# Altium project nRF54L15_miniDevKit.PrjPcb
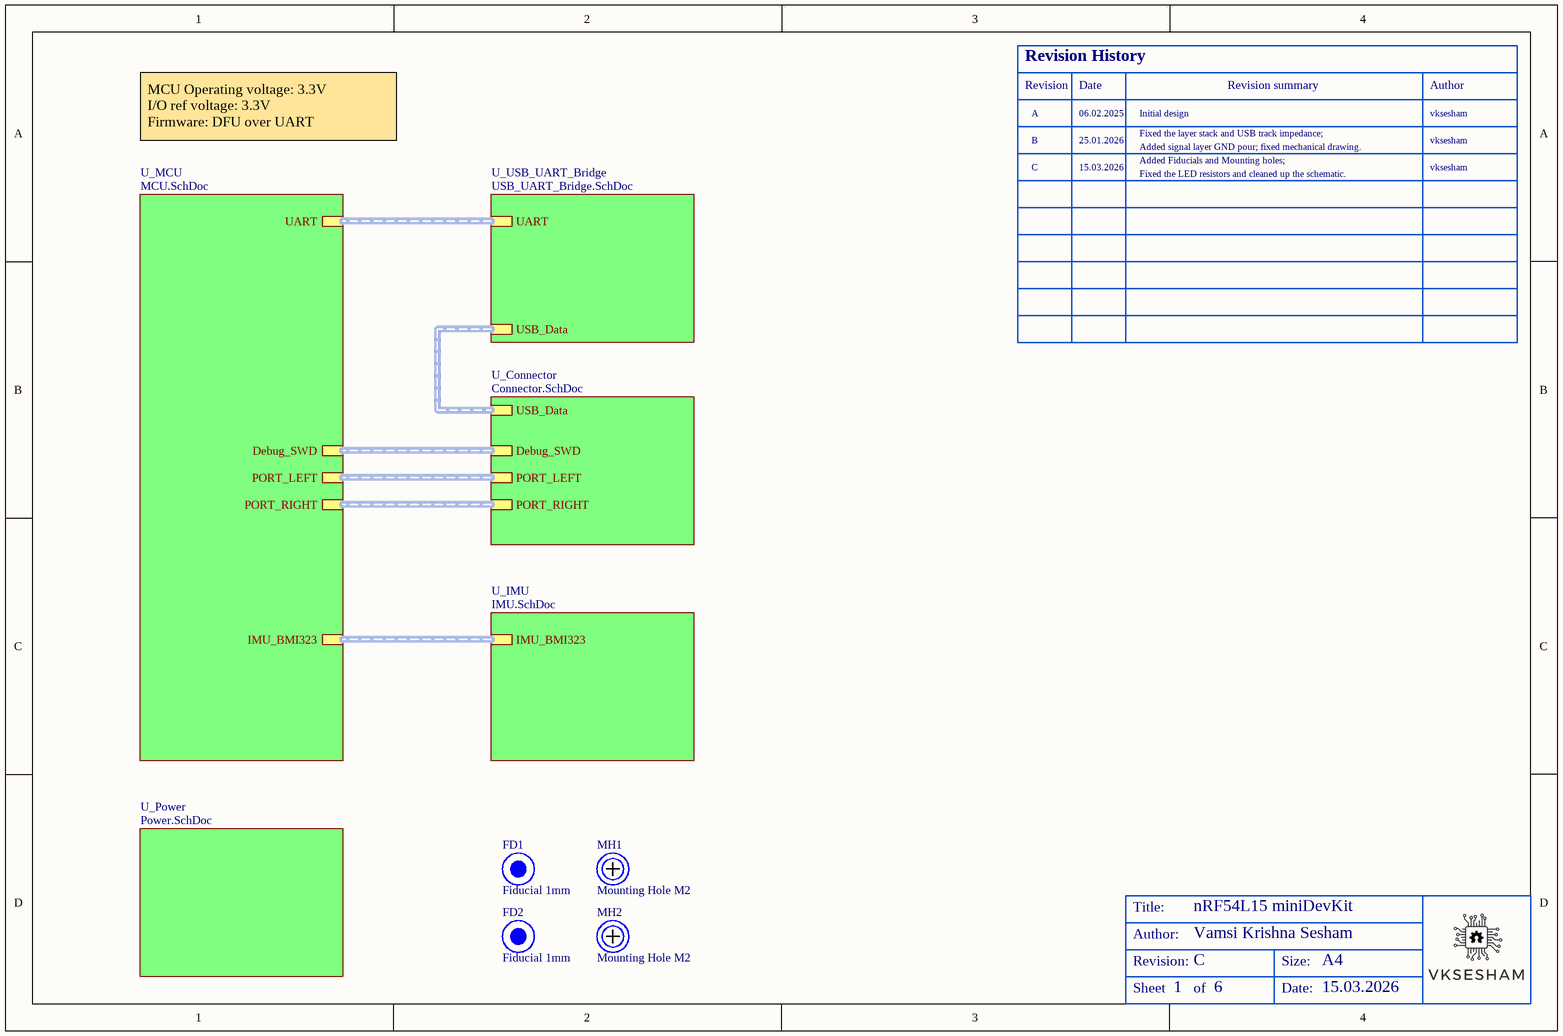
[diagram p0: Top-level.SchDoc]
6 sheets, 68 parts. Net scope: hierarchical (ports join the sheet entries above them; power ports are global).
Board file: PCB1.PcbDoc
Sheets:
  Top-level.SchDoc
    U_MCU = MCU.SchDoc
    U_Connector = Connector.SchDoc
    U_IMU = IMU.SchDoc
    U_Power = Power.SchDoc
    U_USB_UART_Bridge = USB_UART_Bridge.SchDoc

## Sheet Top-level.SchDoc: nRF54L15 miniDevKit
size A4; Date: 15.03.2026; Author: Vamsi Krishna Sesham; DrawnBy: Vamsi Krishna Sesham; Revision: C; SheetNumber: 1; SheetTotal: 6

### Parts
(Parts that share a designator on the sheet are numbered #1, #2 ... from top to bottom, then left to right.)
*#1  RevisionHistory  (value not drawn)  (graphical)
*#2  TitleBlock  (value not drawn)  (graphical)
FD1  Fiducial 1mm  [Fiducial_1mm]  (no BOM)
FD2  Fiducial 1mm  [Fiducial_1mm]  (no BOM)
MH1  Mounting Hole M2  [Mounting Hole M2]  (no BOM)
MH2  Mounting Hole M2  [Mounting Hole M2]  (no BOM)

### Sub-sheets
U_Connector = Connector.SchDoc: USB_Data (harness USB), Debug_SWD (harness SWD), PORT_LEFT (harness Conn_R), PORT_RIGHT (harness Conn_L)
U_IMU = IMU.SchDoc: IMU_BMI323 (harness IMU)
U_MCU = MCU.SchDoc: UART (harness USB_UART), IMU_BMI323 (harness IMU), Debug_SWD (harness SWD), PORT_LEFT (harness Conn_R), PORT_RIGHT (harness Conn_L)
U_Power = Power.SchDoc: no entries
U_USB_UART_Bridge = USB_UART_Bridge.SchDoc: USB_Data (harness USB), UART (harness USB_UART)

### Buses and harness runs
harness sheet U_Connector/Debug_SWD = sheet U_MCU/Debug_SWD
harness sheet U_Connector/PORT_LEFT = sheet U_MCU/PORT_LEFT
harness sheet U_Connector/PORT_RIGHT = sheet U_MCU/PORT_RIGHT
harness sheet U_Connector/USB_Data = sheet U_USB_UART_Bridge/USB_Data
harness sheet U_IMU/IMU_BMI323 = sheet U_MCU/IMU_BMI323
harness sheet U_MCU/UART = sheet U_USB_UART_Bridge/UART

### Notes on the sheet
- A
- 06.02.2025
- Initial design
- vksesham
- MCU Operating voltage: 3.3V
  I/O ref voltage: 3.3V
  Firmware: DFU over UART
- B
- C
- 25.01.2026
- 15.03.2026
- Fixed the layer stack and USB track impedance;
- Added signal layer GND pour; fixed mechanical drawing.
- Added Fiducials and Mounting holes;
- Fixed the LED resistors and cleaned up the schematic.
- (in symbol RevisionHistory) Revision History; Revision; Date; Revision summary; Author
- (in symbol TitleBlock) Title:; Author:; Revision:; Size:; A4; Sheet; of; Date:

## Sheet MCU.SchDoc: MCU
size A4; Date: 15.03.2026; Author: Vamsi Krishna Sesham; DrawnBy: Vamsi Krishna Sesham; Engineer: Vamsi Krishna Sesham; Revision: C; SheetNumber: 2; SheetTotal: 6
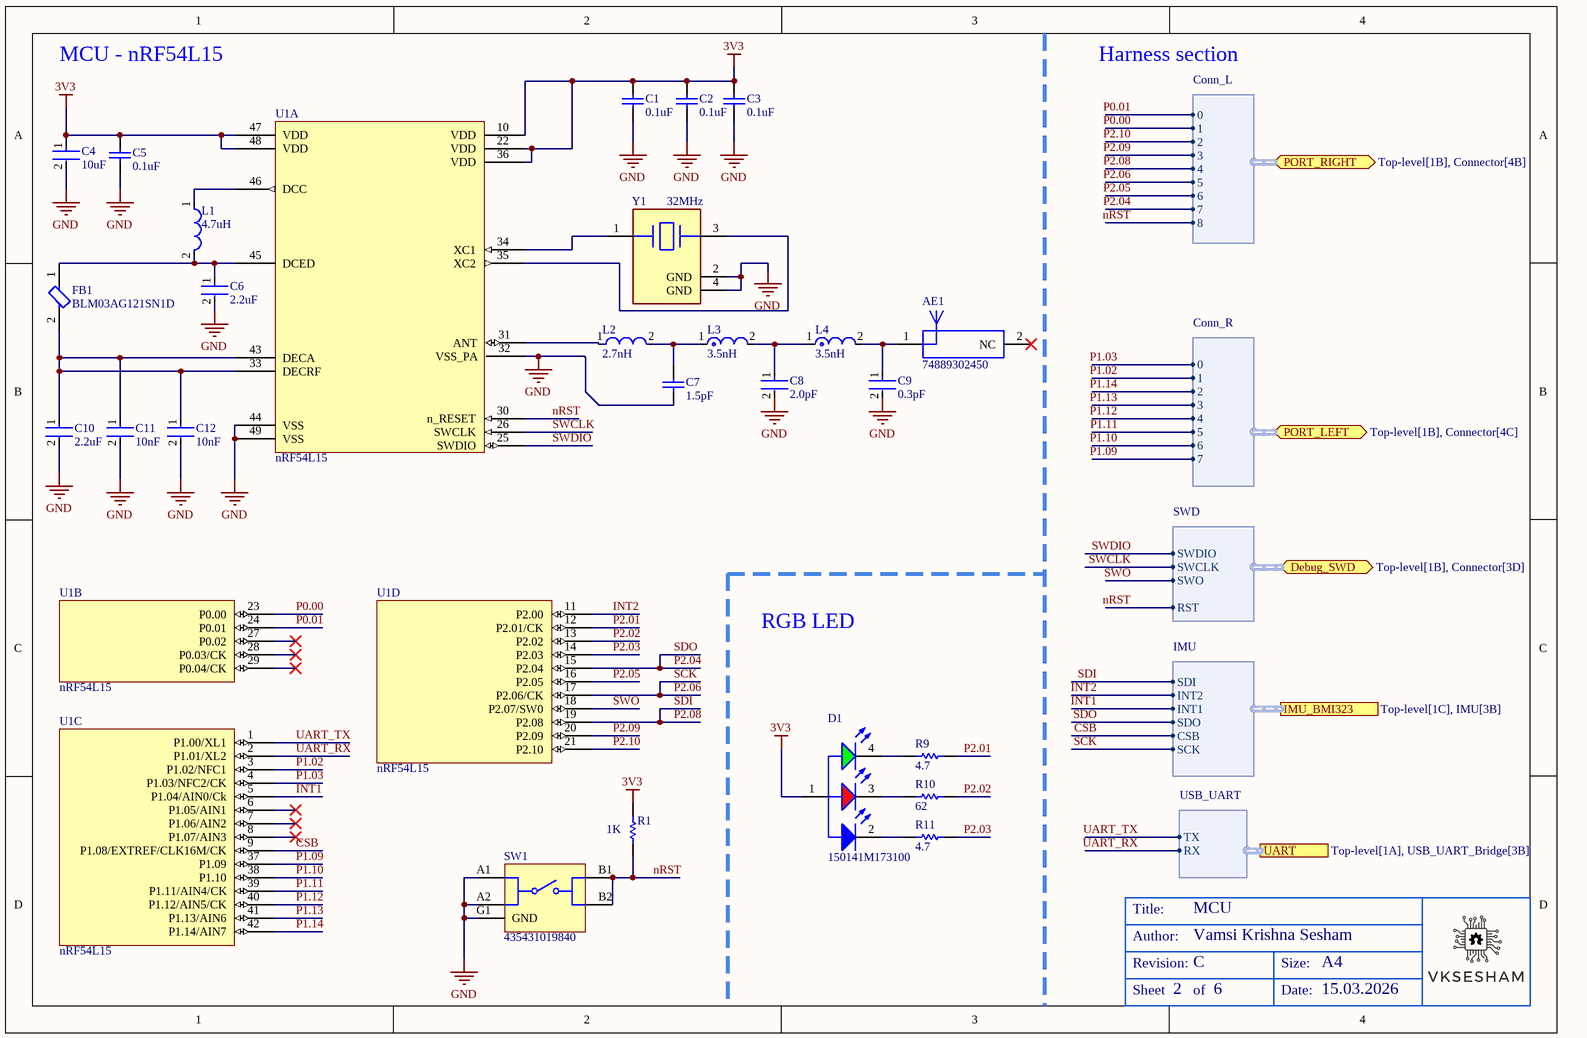
[diagram p1: MCU.SchDoc]

### Parts
(Parts that share a designator on the sheet are numbered #1, #2 ... from top to bottom, then left to right.)
*#3  TitleBlock  (value not drawn)  (graphical)
AE1  74889302450  [74889302450]
C1  0.1uF  [CAPC0603X33X15ML03T05]
C2  0.1uF  [CAPC0603X33X15ML03T05]
C3  0.1uF  [CAPC0603X33X15ML03T05]
C4  10uF  [FP-CL07-IPC_C]
C5  0.1uF  [CAPC0603X33X15ML03T05]
C6  2.2uF  [FP-CL03-IPC_B]
C7  1.5pF  [CAPC0603X33X15NL03T05]
C8  2.0pF  [FP-GRM033-0_03-MFG]
C9  0.3pF  [FP-GJM033-0_03-IPC_A]
C10  2.2uF  [FP-CL03-IPC_B]
C11  10nF  [FP-GRM033-0_03-IPC_B]
C12  10nF  [FP-GRM033-0_03-IPC_B]
D1  150141M173100  [WL-SFTW_3528_150141M173100]
FB1  BLM03AG121SN1D  [FP-BLM03-0_03-d0_3-IPC_A]
L1  4.7uH  [FP-MLZ1608-IPC_A]
L2  2.7nH  [FP-LQP03HQ_02-MFG]
L3  3.5nH  [FP-LQP03TG_02-IPC_C]
L4  3.5nH  [FP-LQP03TG_02-IPC_C]
R1  1K  [RESC0603X28X15ML05T05]
R9  4.7  [RESC0402(1005)_M]
R10  62  [RESC1005X40X25LL05T05]
R11  4.7  [RESC0402(1005)_M]
SW1  435431019840  [435431019840]
U1  nRF54L15  [nRF54L15_QFN8_6X6]  (parts A,B,C,D of 4)
Y1  32MHz  [FP-ABM8G-MFG]

### Ports
Debug_SWD (bidir, harness SWD, see Top-level[1B], Connector[3D]), IMU_BMI323 (harness IMU, see Top-level[1C], IMU[3B]), PORT_LEFT (bidir, harness Conn_R, see Top-level[1B], Connector[4C]), PORT_RIGHT (bidir, harness Conn_L, see Top-level[1B], Connector[4B]), UART (harness USB_UART, see Top-level[1A], USB_UART_Bridge[3B])

### Harnesses
USB_UART: TX, RX
IMU: SDI, INT2, INT1, SDO, CSB, SCK
SWD: SWDIO, SWCLK, SWO, RST
Conn_R: 0, 1, 2, 3, 4, 5, 6, 7
Conn_L: 0, 1, 2, 3, 4, 5, 6, 7, 8

### Nets
3V3: C1.2 C2.2 C3.2 C4.1 C5.2 D1.1(A) R1.2 U1.10(VDD) U1.22(VDD) U1.36(VDD) U1.47(VDD) U1.48(VDD)
GND: C1.1 C2.1 C3.1 C4.2 C5.1 C6.2 C7.1 C8.2 C9.2 C10.2 C11.2 C12.2 SW1.A1 SW1.A2 SW1.G1(GND) U1.32(VSS_PA) U1.44(VSS) U1.49(VSS) Y1.2(GND) Y1.4(GND)
CSB: U1.9(P1.08/EXTREF/CLK16M/CK) ; port IMU_BMI323.CSB
INT1: U1.5(P1.04/AIN0/Ck) ; port IMU_BMI323.INT1
INT2: U1.11(P2.00) ; port IMU_BMI323.INT2
nRST: R1.1 SW1.B1 SW1.B2 U1.30(n_RESET) ; port Debug_SWD.RST, port PORT_RIGHT.8
P0.00: U1.23(P0.00) ; port PORT_RIGHT.1
P0.01: U1.24(P0.01) ; port PORT_RIGHT.0
P1.02: U1.3(P1.02/NFC1) ; port PORT_LEFT.1
P1.03: U1.4(P1.03/NFC2/CK) ; port PORT_LEFT.0
P1.09: U1.37(P1.09) ; port PORT_LEFT.7
P1.10: U1.38(P1.10) ; port PORT_LEFT.6
P1.11: U1.39(P1.11/AIN4/CK) ; port PORT_LEFT.5
P1.12: U1.40(P1.12/AIN5/CK) ; port PORT_LEFT.4
P1.13: U1.41(P1.13/AIN6) ; port PORT_LEFT.3
P1.14: U1.42(P1.14/AIN7) ; port PORT_LEFT.2
P2.01: R9.2 U1.12(P2.01/CK)
P2.02: R10.2 U1.13(P2.02)
P2.03: R11.2 U1.14(P2.03)
P2.04: U1.15(P2.04) ; port IMU_BMI323.SDO, port PORT_RIGHT.7  [also labelled SDO]
P2.05: U1.16(P2.05) ; port PORT_RIGHT.6
P2.06: U1.17(P2.06/CK) ; port IMU_BMI323.SCK, port PORT_RIGHT.5  [also labelled SCK]
P2.08: U1.19(P2.08) ; port IMU_BMI323.SDI, port PORT_RIGHT.4  [also labelled SDI]
P2.09: U1.20(P2.09) ; port PORT_RIGHT.3
P2.10: U1.21(P2.10) ; port PORT_RIGHT.2
SWCLK: U1.26(SWCLK) ; port Debug_SWD.SWCLK
SWDIO: U1.25(SWDIO) ; port Debug_SWD.SWDIO
SWO: U1.18(P2.07/SW0) ; port Debug_SWD.SWO
UART_RX: U1.2(P1.01/XL2) ; port UART.RX
UART_TX: U1.1(P1.00/XL1) ; port UART.TX
NetAE1_1: AE1.1(Feed) C9.1 L4.2
NetC6_1: C6.1 FB1.1 L1.2 U1.45(DCED)
NetC7_2: C7.2 L2.2 L3.1
NetC8_1: C8.1 L3.2 L4.1
NetC10_1: C10.1 C11.1 C12.1 FB1.2 U1.33(DECRF) U1.43(DECA)
NetD1_2: D1.2(K) R11.1
NetD1_3: D1.3(K) R10.1
NetD1_4: D1.4(K) R9.1
NetL1_1: L1.1 U1.46(DCC)
NetL2_1: L2.1 U1.31(ANT)
NetU1_34: U1.34(XC1) Y1.1
NetU1_35: U1.35(XC2) Y1.3

Not connected (* = marked no-connect by the designer): AE1 2(NC)*; U1 6(P1.05/AIN1)* 7(P1.06/AIN2)* 8(P1.07/AIN3)* 27(P0.02)* 28(P0.03/CK)* 29(P0.04/CK)*

### Notes on the sheet
- MCU - nRF54L15
- Harness section
- RGB LED
- (in symbol TitleBlock) Title:; Author:; Revision:; Size:; A4; Sheet; of; Date:

### Library data of the parts
AE1 = CMP-03913-126098687-1: 74889302450 Chip Antenna, 2.45Ghz, 3.2Mm X 1.6Mm X 1.2Mm Rohs Compliant: Yes; Current Rating: 2A; Impedance: 50Ω; RoHS: Compliant; Length: 3.2mm; Width: 1.6mm; NexarPartId: 126098687; Max Operating Temperature: 85°C; Min Operating Temperature: -40°C; Height: 1.2mm
C1-C3 C5 = CMP-2010-00674-1: Manufacturer: Samsung; Part Number: CL03A104KQ3NNNC
C4 = CMP-13271-002778-1: Cap Ceramic 10uF 10V X5R ±20% SMD 0402 +85°C Paper T/R; Length: 0.039inch; Mount: Surface Mount; Case Code (Imperial): 0402; Capacitance: 10uF; Max Operating Temperature: 85°C; Voltage Rating: 10V; Min Operating Temperature: -55°C; Case/Package: 0402; Thickness: 0.035inch; Width: 0.02inch; Case Code (Metric): 1005; Packaging: Tape and Reel; Tolerance: 20%
C6 C10 = CMP-13271-002263-1: Cap Ceramic 2.2uF 10V X5R ±20% Pad SMD 0201 +85°C T/R; Width: 0.012inch; Case Code (Imperial): 0201; Lead Free: Lead Free; Thickness: 0.013inch; Packaging: Tape and Reel; Capacitance: 2.2uF; Min Operating Temperature: -55°C; Case Code (Metric): 0603; Length: 0.024inch; Voltage Rating: 10V; Case/Package: 0201; Mount: Surface Mount; Tolerance: 20%; Max Operating Temperature: 85°C
C7 = CMP-1033-00061-2: Part Number: 02013A1R5CAT2A; Manufacturer: AVX Interconnect / Elco
C8 = CMP-2010-01348-2: Chip Multilayer Ceramic Capacitors for General Purpose, 0201, 2.0pF, C0G, 30ppm/°C, 0.25pF, 25V; Capacitance: 2pF; Voltage Rating (DC): 25V; Case Code (Metric): 0603; REACH SVHC: No SVHC; Length: 0.024inch; Height: 0.3mm; Case Code (Imperial): 0201; Min Operating Temperature: -55°C; Max Operating Temperature: 125°C; Mount: Surface Mount; Thickness: 0.013inch; Dielectric: C0G; Case/Package: 0201; Termination: SMD/SMT; Width: 0.012inch; Package Quantity: 15000; Voltage Rating: 25V; Packaging: Tape and Reel; Lead Free: Lead Free
C9 = CMP-2010-00788-2: Ceramic Capacitor 0.3pF ±0.05pF 25V C0G 0201 (0603 Metric); Case/Package: 0201; Capacitance: 0.3pF; Length: 0.6mm; Voltage Rating (DC): 25V; Max Operating Temperature: 125°C; Mount: Surface Mount; Depth: 0.3mm; Min Operating Temperature: -55°C; Voltage Rating: 25V; Case Code (Imperial): 0201; Dielectric: C0G; Package Quantity: 15000; Lead Free: Lead Free; Width: 0.3mm; Case Code (Metric): 0603; Height: 0.3mm; Radiation Hardening: No; Termination: SMD/SMT; Packaging: Tape and Reel; Thickness: 0.013inch
C11 C12 = CMP-2010-01684-2: Chip Multilayer Ceramic Capacitors for General Purpose, 0201, 10000pF, X7R, 15%, 10%, 10V; Package Quantity: 1; Width: 0.012inch; Voltage: 10V; Mount: Surface Mount; Capacitance: 10nF; Voltage Rating (DC): 10V; Voltage Rating: 10V; Length: 0.6mm; Packaging: Tape and Reel; Material: Ceramic; Dielectric: X7R; REACH SVHC: No SVHC; Termination: SMD/SMT; Case/Package: 0201; Radiation Hardening: No; Height: 0.3mm; Tolerance: 10%; Case Code (Imperial): 0201; Min Operating Temperature: -55°C; Lead Free: Lead Free; Thickness: 0.013inch; Depth: 0.3mm; Case Code (Metric): 0603; Max Operating Temperature: 125°C
D1 = CMP-1431-00001-2: NexarPartId: 29717795; Forward Current: 100mA; Peak Wavelength: 465nm; Viewing Angle: 120°; Color: Green, Red; Max Reverse Voltage (DC): 5V; Forward Voltage: 3.2V; Dominant Wavelength: 520nm; Test Current: 20mA; Power Dissipation: 72mW; Wavelength: 470nm; Lens Style: Clear, Round; Luminous Intensity: 230mcd; Case/Package: 1411; Packaging: Tape and Reel; Case Code (Metric): 3528; Min Operating Temperature: -40°C; Length: 3.5mm; Number of Pins: 4; Width: 2.8mm; Max Operating Temperature: 85°C; Case Code (Imperial): 1411; Height: 1.9mm; REACH SVHC: Unknown; Mount: Surface Mount; RoHS: Compliant
FB1 = CMP-0686-00046-3: Ferrite Bead, 0201, 120Ω @ 100MHz, 25%, 0.5Ω, 200mA; Number of Lines: 1; Impedance: 120R; DC Resistance (DCR): 500mR; Shielding: Unshielded; Material: Steel; Max Current Rating: 200mA; Tolerance: 25%; Case Code (Metric): 0603; Max DC Current: 200mA; Max Operating Temperature: 125°C; Length: 0.6mm; Test Frequency: 100MHz; Package Quantity: 1; Height: 0.3mm; Case Code (Imperial): 0201; Case/Package: 0201; DC Resistance-Max: 500mR; Termination: SMD/SMT; Min Operating Temperature: -55°C; Series: BLM03AG; Core Material: Ferrite; Depth: 0.33mm; Lead Free: Lead Free; Packaging: Tape and Reel; Frequency: 100MHz; Number of Circuits: 1; REACH SVHC: No SVHC; Number of Pins: 2; Current Rating: 200mA; Width: 0.3mm; RoHS Compliant: Yes
L1 = CMP-08253-000311-1: Shielded Multilayer Inductor 4.7uH ±20% 350mA 650mΩ SMD 0603; DC Resistance (DCR): 650mR; Test Frequency: 2MHz; Self Resonant Frequency: 80MHz; Core Material: Ferrite; Saturation Current: 120mA; Packaging: Tape and Reel; Width: 0.031inch; Height - Seated (Max): 0.037inch; Inductance: 4.7uH; Current Rating: 350mA; Max Operating Temperature: 125°C; Tolerance: 20%; Length: 0.063inch; Package Quantity: 4000; Case/Package: 0603; Case Code (Imperial): 0603; Min Operating Temperature: -55°C; Case Code (Metric): 1608; RoHS Compliant: Yes; Shielding: Shielded; Mount: Surface Mount
L2 = CMP-06042-004733-1: Film type RF Inductor 2.7nH ±0.1nH 600mA 0.12Ω 0201 (0603); Self Resonant Frequency: 9GHz; Shielding: Unshielded; Test Frequency: 500MHz; DC Resistance (DCR): 120mR; Core Material: Non-Magnetic; Current Rating: 600mA; Max Operating Temperature: 125°C; Case/Package: 0201; Case Code (Metric): 0603; Inductance: 2.7nH; Case Code (Imperial): 0201; Min Operating Temperature: -55°C; Mount: Surface Mount; Resistor Type: Thin Film; Packaging: Tape and Reel
L3 L4 = CMP-06042-011870-1: Film type RF Inductor 3.5nH ±0.1nH 450mA 0.25Ω 0201 (0603); DC Resistance (DCR): 250mR; Shielding: Unshielded; Core Material: Non-Magnetic; Self Resonant Frequency: 7GHz; Q Factor: 14; Test Frequency: 500MHz; Current Rating: 450mA; Resistor Type: Thin Film; Max DC Current: 450mA; Case/Package: 0201; Case Code (Metric): 0603; Lead Free: Lead Free; Height: 0.3mm; Height - Seated (Max): 0.013inch; Case Code (Imperial): 0201; Length: 0.024inch; Packaging: Tape and Reel; Package Quantity: 15000; Mount: Surface Mount; Max Operating Temperature: 125°C; Termination: SMD/SMT; Width: 0.012inch; Min Operating Temperature: -55°C; Inductance: 3.5nH
R1 = CMP-2004-00209-1: Manufacturer: Vishay Dale; Part Number: CRCW02011K00FNED
R9 R11 = CMP-1011-00018-1: 4R7 0.063W 5% 0402 (1005 Metric)  SMD; Value: 4.70 Ohm; Case-EIA: 0402; Case-Metric: 1005; Power: 0.063 W; Technology: SMT; Tolerance: 5 %
R10 = CMP-2002-00152-1: Part Number: CRCW040262R0JNED; Manufacturer: Vishay Dale
SW1 = CMP-03913-134708202-2: Tactile Switch, 0.05A, 32VDC, SMD, 400GF Rohs Compliant: Yes; Voltage Rating: 32V; Current Rating: 50mA; Insulation Resistance: 1GΩ; RoHS: Compliant; Packaging: Tape and Reel; Max Operating Temperature: 125°C; Contact Plating: Silver; Min Operating Temperature: -55°C
U1 = nRF54L15_QFN8_6X6: Ultra-low-power wireless SoC; Manufacturer 1: Nordic Semiconductor; Manufacturer Part Number 1: NRF54L15-QFAA-R7
Y1 = CMP-27762-014975-1: Crystal 32MHz ±30ppm (Tol) ±30ppm (Stability) 10pF FUND 50Ω 4-Pin SMD T/R; ESR (Equivalent Series Resistance): 50R; Depth: 2.5mm; Frequency: 32MHz; Min Operating Temperature: -20°C; Lead Free: Lead Free; Termination: SMD/SMT; Load Capacitance: 10pF; Mount: Surface Mount; Max Operating Temperature: 70°C; Frequency Stability: 30ppm; Series: ABM8G; Tolerance: 30ppm; Width: 2.5mm; Packaging: Tape and Reel; Frequency Tolerance: 30ppm; Package Quantity: 1000; Series Resistance: 50R; Number of Pins: 4; Length: 3.2mm; Case/Package: CSMD; Height: 1mm

## Sheet Connector.SchDoc: Connector
size A4; Date: 15.03.2026; Author: Vamsi Krishna Sesham; DrawnBy: Vamsi Krishna Sesham; Engineer: Vamsi Krishna Sesham; Revision: C; SheetNumber: 3; SheetTotal: 6
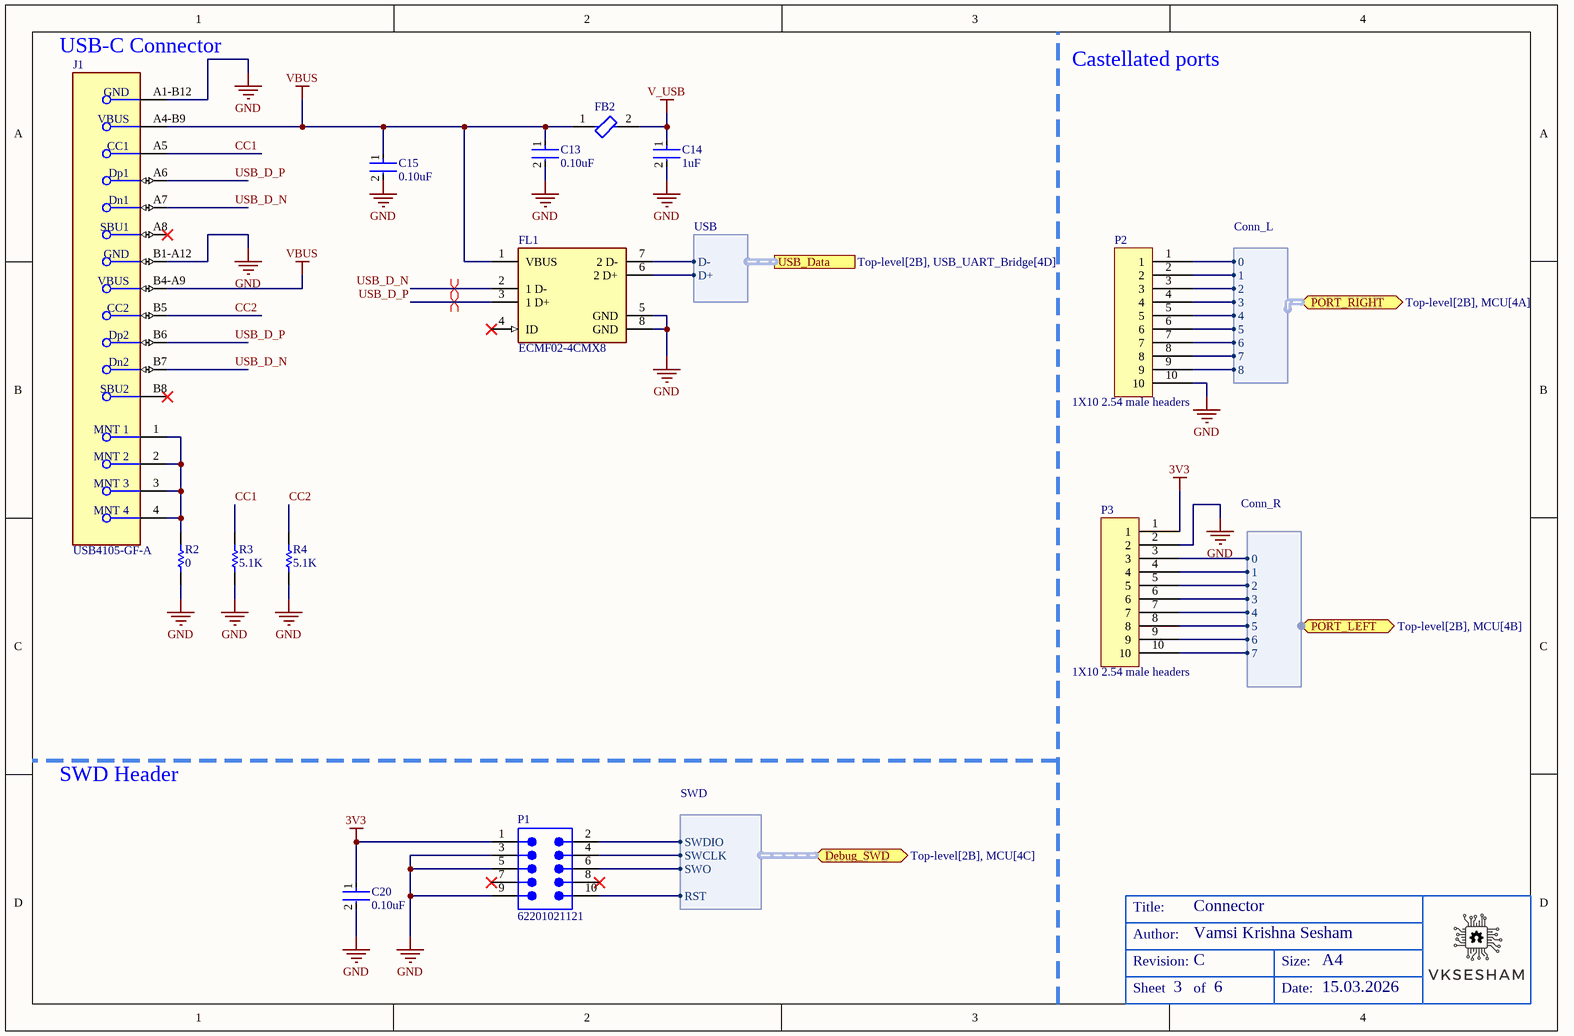
[diagram p2: Connector.SchDoc]

### Parts
(Parts that share a designator on the sheet are numbered #1, #2 ... from top to bottom, then left to right.)
*#4  TitleBlock  (value not drawn)  (graphical)
C13  0.10uF  [FP-GRM033-0_03-MFG]
C14  1uF  [FP-CL03-IPC_C]
C15  0.10uF  [FP-GRM033-0_03-MFG]
C20  0.10uF  [FP-GRM033-0_03-MFG]
FB2  (no value)  [FP-BLM03-0_03-d0_3-IPC_C]
FL1  ECMF02-4CMX8  [FP-Micro_QFN-8L-MFG]
J1  USB4105-GF-A  [FP-USB4105-GF-A-MFG]
P1  62201021121  [62201021121]
P2  1X10 2.54 male headers  [Male_Headers_254_1x10]  (no BOM)
P3  1X10 2.54 male headers  [Male_Headers_254_1x10]  (no BOM)
R2  0  [RESC1005X40X25NL05T10]
R3  5.1K  [RESC0603X26X15NL03T05]
R4  5.1K  [RESC0603X26X15NL03T05]

### Ports
Debug_SWD (bidir, harness SWD, see Top-level[2B], MCU[4C]), PORT_LEFT (bidir, harness Conn_R, see Top-level[2B], MCU[4B]), PORT_RIGHT (bidir, harness Conn_L, see Top-level[2B], MCU[4A]), USB_Data (harness USB, see Top-level[2B], USB_UART_Bridge[4D])

### Harnesses
USB: D-, D+
SWD: SWDIO, SWCLK, SWO, RST
Conn_R: 0, 1, 2, 3, 4, 5, 6, 7
Conn_L: 0, 1, 2, 3, 4, 5, 6, 7, 8

### Nets
3V3: C20.1 P1.1 P3.1
GND: C13.2 C14.2 C15.2 C20.2 FL1.5(GND) FL1.8(GND) J1.A1-B12(GND) J1.B1-A12(GND) P1.3 P1.5 P1.9 P2.10 P3.2 R2.1 R3.1 R4.1
V_USB: C14.1 FB2.2
VBUS: C13.1 C15.1 FB2.1 FL1.1(VBUS) J1.A4-B9(VBUS) J1.B4-A9(VBUS)
CC1: J1.A5(CC1) R3.2
CC2: J1.B5(CC2) R4.2
nRST: P1.10 P2.9 ; port Debug_SWD.RST, port PORT_RIGHT.8
P0.00: P2.2 ; port PORT_RIGHT.1
P0.01: P2.1 ; port PORT_RIGHT.0
P1.02: P3.4 ; port PORT_LEFT.1
P1.03: P3.3 ; port PORT_LEFT.0
P1.09: P3.10 ; port PORT_LEFT.7
P1.10: P3.9 ; port PORT_LEFT.6
P1.11: P3.8 ; port PORT_LEFT.5
P1.12: P3.7 ; port PORT_LEFT.4
P1.13: P3.6 ; port PORT_LEFT.3
P1.14: P3.5 ; port PORT_LEFT.2
P2.04: P2.8 ; port PORT_RIGHT.7
P2.05: P2.7 ; port PORT_RIGHT.6
P2.06: P2.6 ; port PORT_RIGHT.5
P2.08: P2.5 ; port PORT_RIGHT.4
P2.09: P2.4 ; port PORT_RIGHT.3
P2.10: P2.3 ; port PORT_RIGHT.2
SWCLK: P1.4 ; port Debug_SWD.SWCLK
SWDIO: P1.2 ; port Debug_SWD.SWDIO
SWO: P1.6 ; port Debug_SWD.SWO
USB_D_N: FL1.2(1_D-) J1.A7(Dn1) J1.B7(Dn2)
USB_D_P: FL1.3(1_D+) J1.A6(Dp1) J1.B6(Dp2)
USBD_N: FL1.6(2_D+) ; port USB_Data.D+
USBD_P: FL1.7(2_D-) ; port USB_Data.D-
NetJ1_1: J1.1(MNT_1) J1.2(MNT_2) J1.3(MNT_3) J1.4(MNT_4) R2.2

Not connected (* = marked no-connect by the designer): FL1 4(ID)*; J1 A8(SBU1)* B8(SBU2)*; P1 7* 8*

### Layout directives
differential pair: USB_D_N, USB_D_P

### Notes on the sheet
- (near J1) USB-C Connector
- Castellated ports
- SWD Header
- (in symbol TitleBlock) Title:; Author:; Revision:; Size:; A4; Sheet; of; Date:

### Library data of the parts
C13 C15 C20 = CMP-06035-019037-1: Chip Multilayer Ceramic Capacitors for General Purpose, 0201, 0.10uF, X7S, 22%, 10%, 16V; Capacitance: 100nF; Dielectric: X7S; Tolerance: 10%; Voltage Rating (DC): 16V; Height: 0.3mm; Max Operating Temperature: 125°C; Case Code (Metric): 0603; Termination: SMD/SMT; Min Operating Temperature: -55°C; Mount: Surface Mount; Case/Package: 0201; Weight: 1.2E-05oz; Package Quantity: 15000; Length: 0.024inch; Voltage Rating: 16V; Case Code (Imperial): 0201; Packaging: Tape and Reel; Thickness: 0.013inch; Width: 0.3mm
C14 = CMP-13271-000008-1: CAP CER 1UF 16V X5R 0201; Manufacturer Part Number: CL03A105MO3NRNH; Manufacturer: Samsung Electro-Mechanics; Tolerance: 20%; Material: Ceramic; Temperature Coefficient: 15%; Automotive: No; Temperature Range High: +85°C; Temperature: -55°C to +85°C; Package: CL03; Capacitance: 1uF; Temperature Range Low: -55°C; Height: 0.39mm; ComponentLink2URL: http://www.samsungsem.com/global/front/downloadcms.do?path=%2F%2Fglobal%2F%2Fsupport%2F%2Fproduct-search%2F%2Fmlcc%2F%2F__icsFiles%2F%2Fafieldfile%2F%2F2018%2F%2F06%2F%2F21&fileName=CL03A105MO3NRNH.pdf; RoHS: TRUE; Value: 1uF; Lead Free: Yes; Voltage Rating: 16V; Octopart: https://octopart.com/cl03a105mo3nrnh-samsung-47681184; Device Class L2: Capacitors; ComponentLink2Description: Datasheet; Device Class L3: Ceramic Capacitors; Digikey Description: CAP CER 1UF 16V X5R 0201; Category: Cap; Temperature Characteristic: X5R; Device Class L1: Passive Components; Ipc Land Pattern Name: CAPC6030X30
FB2 = CMP-06046-002105-1: BLM03EB500SH1D, Ferrite Bead, 0201, 50Ω @ 100MHz, 25%, 0.58Ω, 400mA; RoHS Compliant: Yes
FL1 = CMP-12075-000002-1: COMMON MODE CHOKE 2LN SMD ESD; Number of Lines: 2; DC Resistance (DCR): 4R; Package Quantity: 3000; Case/Package: QFN; Width: 0.047inch; Mount: Surface Mount; Termination: Flat; Length: 0.098inch; Height: 0.022inch; Lead Free: Lead Free; Depth: 1.25mm; REACH SVHC: No SVHC; Max Operating Temperature: 85°C; Min Operating Temperature: -30°C; Number of Pins: 8; Packaging: Tape and Reel
J1 = CMP-245163-000001-1: CONN RCPT USB2.0 TYPEC 5A; Manufacturer: GCT; Voltage Rating: 20V; Is Female: yes; Current Rating: 5/6.25/1.25/0.25A; Number Of Contacts: 16; Conn Orientation: Right Angle; Device Class L1: Connectors; Category: Conn; Lead Free: Yes; RoHS: TRUE; Temperature Range High: +85°C; Digikey Description: CONN RCPT USB2.0 TYPEC 5A; Device Class L3: unset; ComponentLink2Description: Datasheet; Manufacturer Part Number: USB4105-GF-A; Package: 0; Usb Standard: USB 2.0; Device Class L2: USB Connectors; Automotive: No; Temperature Range Low: -40°C; Height: 3.46mm; Temperature: -40°C to +85°C; Contact Material: Gold,Nickel; ComponentLink2URL: https://gct.co/files/drawings/usb4105.pdf; Octopart: https://octopart.com/usb4105-gf-a-gct-106627878
P1 = CMP-1502-00948-3: NexarPartId: 32855586; Pitch: 1.27mm; Operating Supply Voltage: 100V; Connector Type: Male Pin; Contact Resistance: 20mΩ; Current Rating: 1A; Number of Contacts: 10; Gender: Male; Contact Mating Length: 3.81mm; Max Operating Temperature: 105°C; Mount: Through Hole; Number of Pins: 10; Row Spacing: 1.27mm; Lead Pitch: 1.27mm; REACH SVHC: Unknown; Min Operating Temperature: -40°C; Contact Material: Copper; Orientation: Vertical; Contact Plating: Gold; Number of Rows: 2; RoHS: Compliant; Packaging: Box; Voltage Rating: 100V; Color: Black; Height: 5.65mm; Termination: Solder; Number of Positions: 10
P2 P3 = Male_Headers_254_1x10
R2 = CMP-1011-00001-2: Manufacturer: Yageo / Phycomp; Part Number: RC0402JR-070RL
R3 R4 = CMP-2004-02525-1: Part Number: MCRE000157; Manufacturer: Multicomp

## Sheet IMU.SchDoc: IMU
size A4; Date: 15.03.2026; Author: Vamsi Krishna Sesham; DrawnBy: Vamsi Krishna Sesham; Engineer: Vamsi Krishna Sesham; Revision: C; SheetNumber: 6; SheetTotal: 6
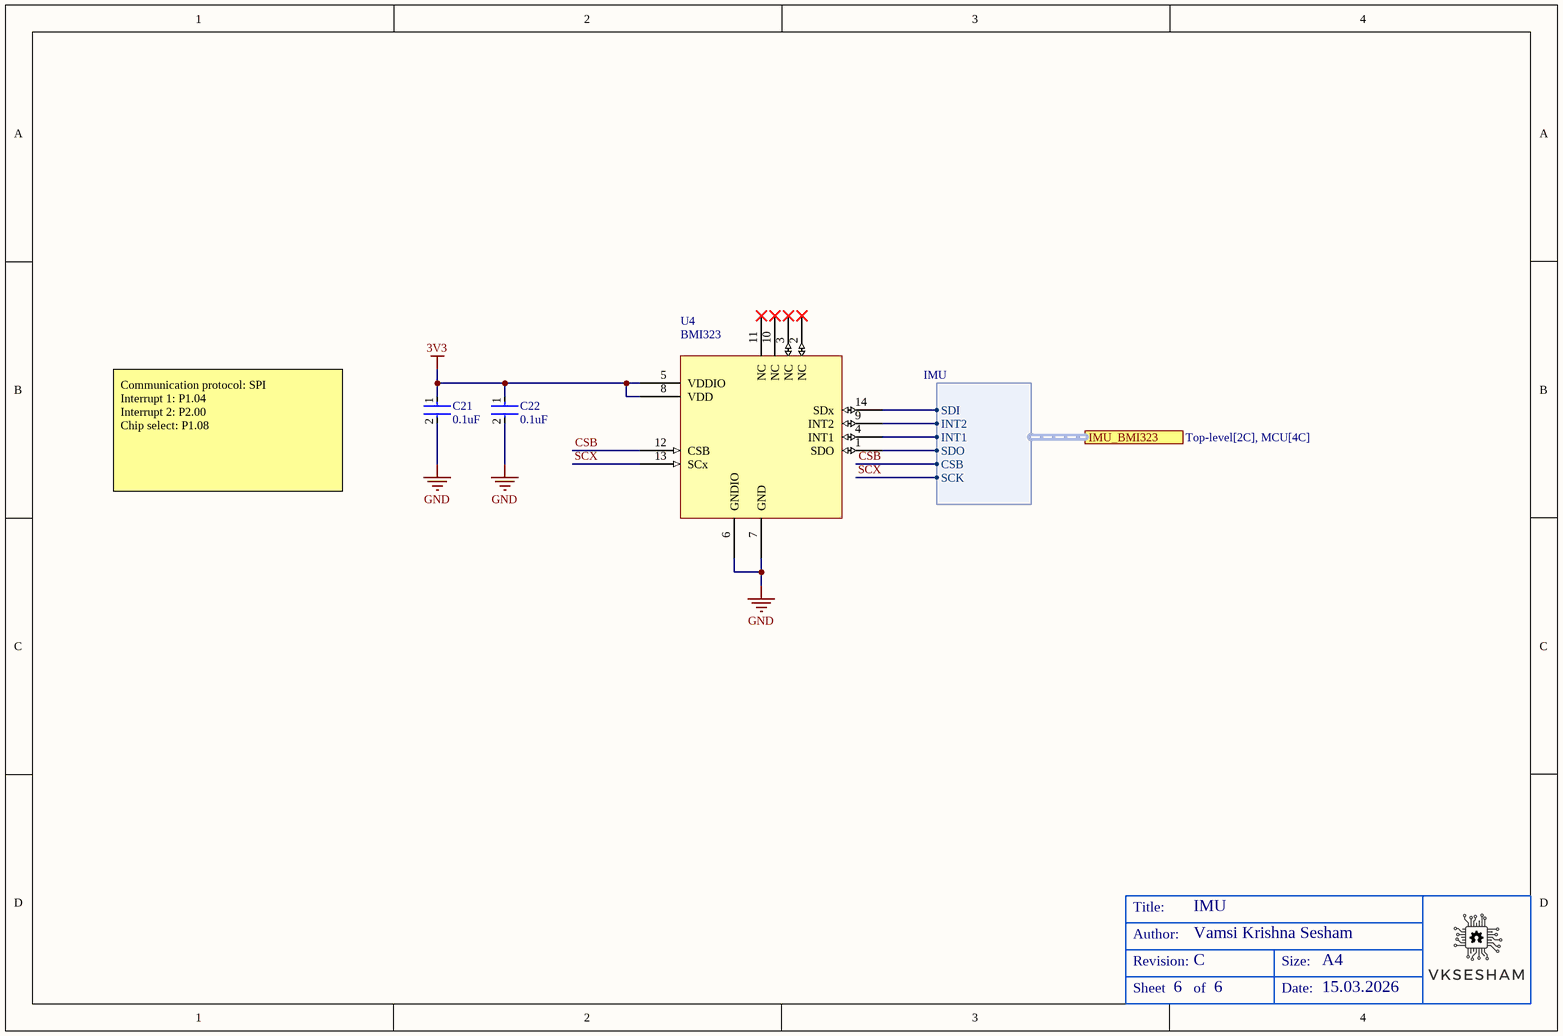
[diagram p3: IMU.SchDoc]

### Parts
(Parts that share a designator on the sheet are numbered #1, #2 ... from top to bottom, then left to right.)
*#5  TitleBlock  (value not drawn)  (graphical)
C21  0.1uF  [FP-GRM033-0_03-MFG]
C22  0.1uF  [FP-GRM033-0_03-MFG]
U4  BMI323  [BMI323]

### Ports
IMU_BMI323 (harness IMU, see Top-level[2C], MCU[4C])

### Harnesses
IMU: SDI, INT2, INT1, SDO, CSB, SCK

### Nets
3V3: C21.1 C22.1 U4.5(VDDIO) U4.8(VDD)
GND: C21.2 C22.2 U4.6(GNDIO) U4.7(GND)
CSB: U4.12(CSB) ; port IMU_BMI323.CSB
INT1: U4.4(INT1) ; port IMU_BMI323.INT1
INT2: U4.9(INT2) ; port IMU_BMI323.INT2
P2.04: U4.1(SDO) ; port IMU_BMI323.SDO
P2.08: U4.14(SDx) ; port IMU_BMI323.SDI
SCX: U4.13(SCx) ; port IMU_BMI323.SCK  [project net P2.06]

Not connected (* = marked no-connect by the designer): U4 2(NC)* 3(NC)* 10(NC)* 11(NC)*

### Notes on the sheet
- Communication protocol: SPI
  Interrupt 1: P1.04
  Interrupt 2: P2.00
  Chip select: P1.08
- (in symbol TitleBlock) Title:; Author:; Revision:; Size:; A4; Sheet; of; Date:

### Library data of the parts
C21 C22 = CMP-06035-019037-1: as C13 on sheet Connector; Dielectric: X7S; Tolerance: 10%; Voltage Rating (DC): 16V; Height: 0.3mm; Max Operating Temperature: 125°C; Case Code (Metric): 0603; Termination: SMD/SMT; Min Operating Temperature: -55°C; Mount: Surface Mount; Case/Package: 0201; Weight: 1.2E-05oz; Package Quantity: 15000; Length: 0.024inch; Voltage Rating: 16V; Case Code (Imperial): 0201; Packaging: Tape and Reel; Thickness: 0.013inch; Width: 0.3mm
U4 = BMI323: Bosch 6-axis IMU; Manufacturer 1: Bosch Sensortec; Manufacturer Part Number 1: BMI323

## Sheet Power.SchDoc: Power
size A4; Date: 15.03.2026; Author: Vamsi Krishna Sesham; DrawnBy: Vamsi Krishna Sesham; Engineer: Vamsi Krishna Sesham; Revision: C; SheetNumber: 4; SheetTotal: 6
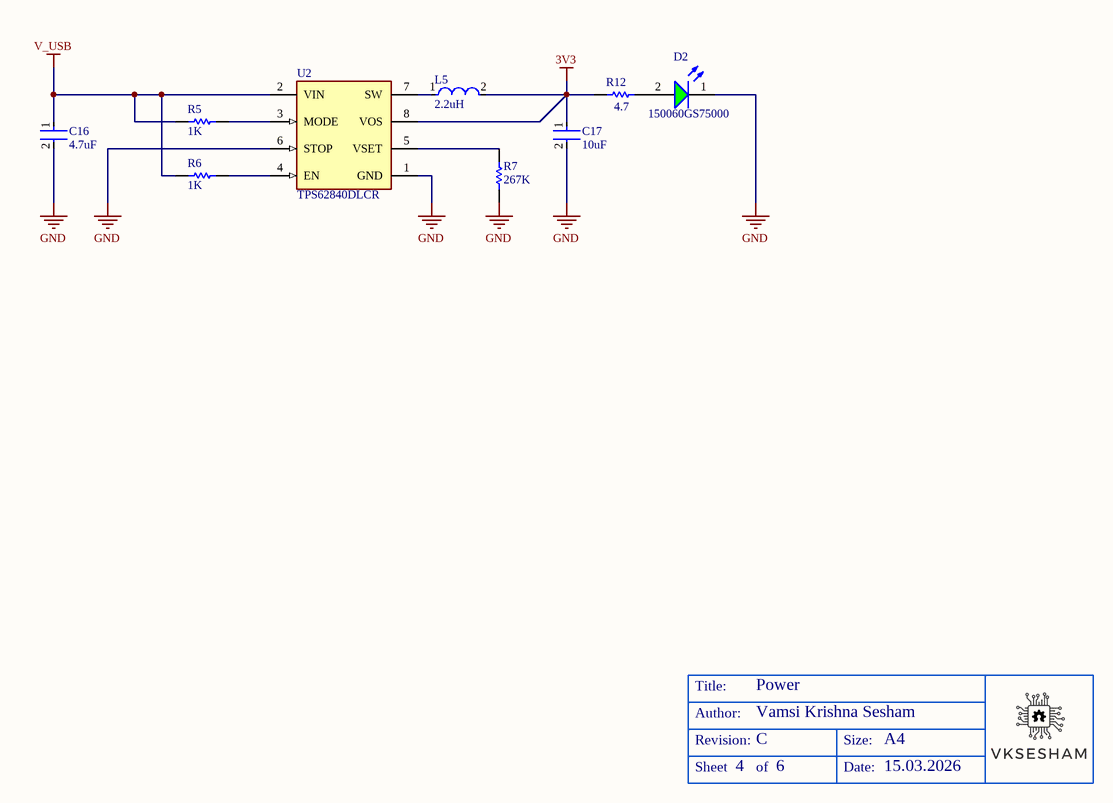
[diagram p4: Power.SchDoc]

### Parts
(Parts that share a designator on the sheet are numbered #1, #2 ... from top to bottom, then left to right.)
*#6  TitleBlock  (value not drawn)  (graphical)
C16  4.7uF  [FP-CC0402-MFG]
C17  10uF  [FP-CL07-IPC_C]
D2  150060GS75000  [WL-SMCW_0603_150060xx75000]
L5  2.2uH  [FP-DFE201612C-MFG]
R5  1K  [RESC0603X28X15ML05T05]
R6  1K  [RESC0603X28X15ML05T05]
R7  267K  [RESC1005X40X25ML05T05]
R12  4.7  [RESC0402(1005)_M]
U2  TPS62840DLCR  [FP-DLC0008B-MFG]

### Nets
3V3: C17.1 L5.2 R12.1 U2.8(VOS)
GND: C16.2 C17.2 D2.1(K) R7.1 U2.1(GND) U2.6(STOP)
V_USB: C16.1 R5.1 R6.1 U2.2(VIN)
NetD2_2: D2.2(A) R12.2
NetL5_1: L5.1 U2.7(SW)
NetR5_2: R5.2 U2.3(MODE)
NetR6_2: R6.2 U2.4(EN)
NetR7_2: R7.2 U2.5(VSET)

### Notes on the sheet
- (in symbol TitleBlock) Title:; Author:; Revision:; Size:; A4; Sheet; of; Date:

### Library data of the parts
C16 = CMP-03422-000819-1: CAP CER 4.7UF 16V X5R 0402; Manufacturer Part Number: CC0402MRX5R7BB475; Manufacturer: YAGEO; Tolerance: 0.2; Automotive Grade: NA; Material: Ceramic; Temperature Coefficient: 30ppm/°C; Digikey Description: CAP CER 4.7UF 16V X5R 0402; Capacitance: 4.7 uF; Lead Free: Yes; Octopart: https://octopart.com/cc0402mrx5r7bb475-yageo-81932628; Device Class L3: Ceramic Capacitors; Ipc Land Pattern Name: CAPC10050X50; Package: CC0402; Temperature: -55°C to +125°C; Device Class L2: Capacitors; Value: 4.7 uF; Temperature Characteristic: X5R; ComponentLink2URL: http://www.yageo.com/documents/recent/UPY-GP_NP0_16V-to-50V_16.pdf; Temperature Range Low: -55°C; Automotive: No; ComponentLink2Description: Datasheet; Category: Cap; Mouser Description: Multilayer Ceramic Capacitors MLCC - SMD/SMT 4.7uF 16V 20% Ceramic Capacitor; Temperature Range High: +125°C; Voltage Rating: 16 V; Footprint Url: http://www.yageo.com/exep/pages/download/literatures/UPY-C_GEN_24.pdf; Height: 0.55mm; RoHS: TRUE; Device Class L1: Passive Components
C17 = CMP-13271-002778-1: as C4 on sheet MCU; Length: 0.039inch; Mount: Surface Mount; Case Code (Imperial): 0402; Capacitance: 10uF; Max Operating Temperature: 85°C; Voltage Rating: 10V; Min Operating Temperature: -55°C; Case/Package: 0402; Thickness: 0.035inch; Width: 0.02inch; Case Code (Metric): 1005; Packaging: Tape and Reel; Tolerance: 20%
D2 = CMP-1426-00002-4: 430mcd Colorless transparence 520nm Emerald 140° LED0603 Light Emitting Diodes (LED) ROHS; Peak Wavelength: 515nm; Forward Current: 100mA; Reverse Voltage: 5V; Output Current: 10µA; Power Dissipation: 105mW; Lens Style: Clear, Rectangular; Dominant Wavelength: 525nm; Color: Green; Test Current: 20mA; Max Junction Temperature (Tj): 95°C; Forward Voltage: 3.2V; Width: 800µm; Max Operating Temperature: 85°C; Case Code (Metric): 1608; Luminous Intensity: 430mcd; Lead Free: Lead Free; Case/Package: 0603; Case Code (Imperial): 0603; Mount: Surface Mount; Max Reverse Voltage (DC): 5V; Packaging: Tape and Reel; RoHS: Compliant; Viewing Angle: 140°; REACH SVHC: Unknown; Min Operating Temperature: -40°C; Height: 700µm; Wavelength: 525nm; Length: 1.6mm
L5 = CMP-06042-009962-1: Shielded Wirewound Inductor 2.2uH 20% 1800mA 0.116Ω 0806 (2016)
R5 R6 = CMP-2004-00209-1: as R1 on sheet MCU
R7 = CMP-2002-00823-1: Part Number: ERJ-2RKF2673X; Manufacturer: Panasonic
R12 = CMP-1011-00018-1: as R9 on sheet MCU; Power: 0.063 W; Technology: SMT; Tolerance: 5 %
U2 = CMP-04918-000086-1: ULTRA LOW IQ BUCK CONVERTER; Manufacturer: Texas Instruments; Standoff Height: 0mm; Nominal Supply Current: 0.005-3000uA; Switching Frequency: 1.8MHz; Max Duty Cycle: 100%; Min Supply Voltage: 1.8V; Output Current: 750mA; Max Supply Voltage: 6.5V; Max Junction Temp: +125°C; Output Type: AdjustableProgrammable; Output Voltage: 1.8-3.3V; Number Of Outputs: 1; Device Class L1: Integrated Circuits (ICs); Device Class L3: Voltage Regulators - Switching; RoHS: TRUE; Automotive: No; Package: DLC0008B; ComponentLink2URL: http://www.ti.com/lit/ds/symlink/tps62840.pdf; Height: 1mm; Lead Free: Yes; Octopart: https://octopart.com/tps62840dlcr-texas+instruments-103121111; Mouser Description: 60-nA IQ, 1.8-V to 6.5-VIN, high-efficiency 750-mA step-down converter 8-VSON-HR -40 to 125; Manufacturer Part Number: TPS62840DLCR; Ipc Land Pattern Name: DFN200X150X100-8; Temperature: -40°C to +125°C; ComponentLink2Description: Datasheet; Switching Topology: Buck; Temperature Range Low: -40°C; Device Class L2: Power Management ICs; Temperature Range High: +125°C; Digikey Description: ULTRA LOW IQ BUCK CONVERTER; Category: IC

## Sheet USB_UART_Bridge.SchDoc: USB_UART
size A4; Date: 15.03.2026; Author: Vamsi Krishna Sesham; DrawnBy: Vamsi Krishna Sesham; Engineer: Vamsi Krishna Sesham; Revision: C; SheetNumber: 5; SheetTotal: 6
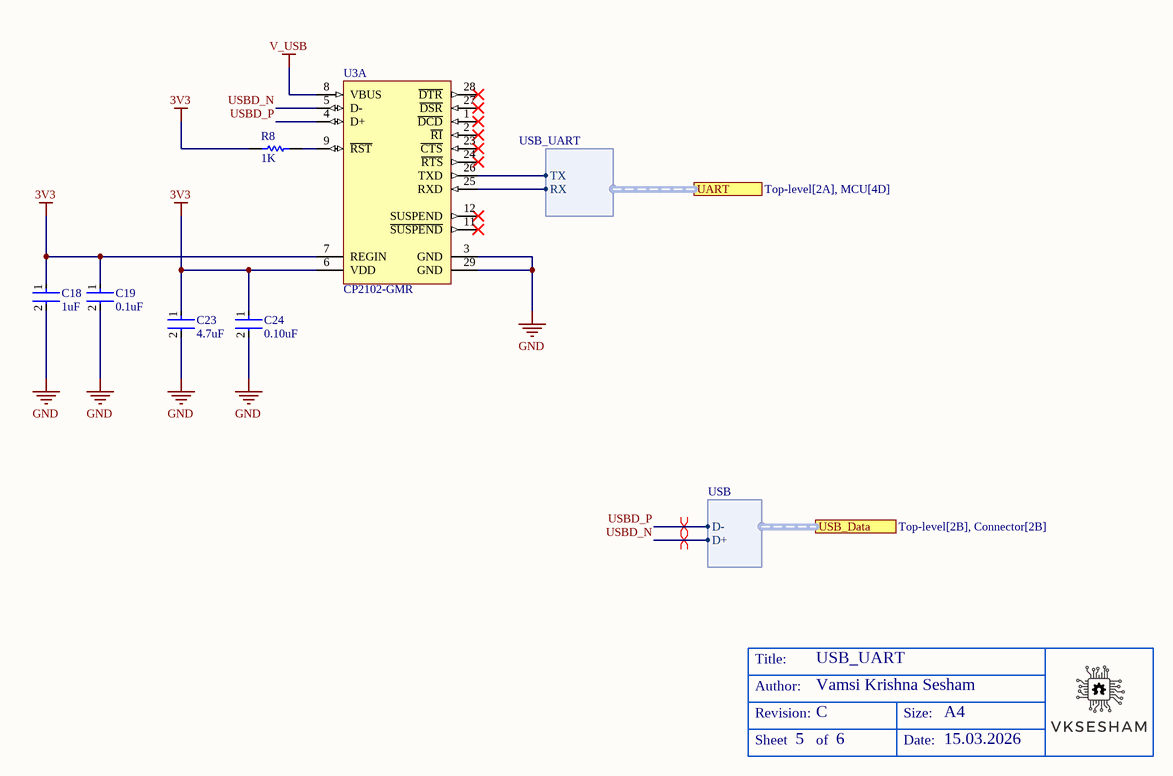
[diagram p5: USB_UART_Bridge.SchDoc]

### Parts
(Parts that share a designator on the sheet are numbered #1, #2 ... from top to bottom, then left to right.)
*#7  TitleBlock  (value not drawn)  (graphical)
C18  1uF  [FP-GRM033-0_09-IPC_A]
C19  0.1uF  [FP-GRM033-0_03-MFG]
C23  4.7uF  [FP-CC0402-MFG]
C24  0.10uF  [FP-GRM033-0_03-MFG]
R8  1K  [RESC0603X28X15ML05T05]
U3  CP2102-GMR  [SLAB-QFN-28-3125x3125TP_M]  (part A of 2)

### Ports
UART (harness USB_UART, see Top-level[2A], MCU[4D]), USB_Data (harness USB, see Top-level[2B], Connector[2B])

### Harnesses
USB: D-, D+
USB_UART: TX, RX

### Nets
3V3: C18.1 C19.1 C23.1 C24.1 R8.1 U3.6(VDD) U3.7(REGIN)
GND: C18.2 C19.2 C23.2 C24.2 U3.3(GND) U3.29(GND)
V_USB: U3.8(VBUS)
UART_RX: U3.25(RXD) ; port UART.RX
UART_TX: U3.26(TXD) ; port UART.TX
USBD_N: U3.5(D-) ; port USB_Data.D+
USBD_P: U3.4(D+) ; port USB_Data.D-
NetR8_2: R8.2 U3.9(~{RST})

Not connected (* = marked no-connect by the designer): U3 1(~{DCD})* 2(~{RI})* 11(~{SUSPEND})* 12(SUSPEND)* 23(~{CTS})* 24(~{RTS})* 27(~{DSR})* 28(~{DTR})*

### Layout directives
differential pair: USBD_N, USBD_P

### Notes on the sheet
- (in symbol TitleBlock) Title:; Author:; Revision:; Size:; A4; Sheet; of; Date:

### Library data of the parts
C18 = CMP-06035-002798-1: Chip Multilayer Ceramic Capacitors for General Purpose, 0201, 1.0uF, X5R, 15%, 20%, 10V; Capacitance: 1uF; Tolerance: 20%; Case Code (Metric): 0603; Voltage Rating (DC): 10V; Min Operating Temperature: -55°C; Mount: Surface Mount; Width: 0.012inch; Dielectric: X5R; Packaging: Tape and Reel; Voltage Rating: 10V; Thickness: 0.015inch; Case Code (Imperial): 0201; Length: 0.024inch; Case/Package: 0201; Max Operating Temperature: 85°C
C19 C24 = CMP-06035-019037-1: as C13 on sheet Connector; Dielectric: X7S; Tolerance: 10%; Voltage Rating (DC): 16V; Height: 0.3mm; Max Operating Temperature: 125°C; Case Code (Metric): 0603; Termination: SMD/SMT; Min Operating Temperature: -55°C; Mount: Surface Mount; Case/Package: 0201; Weight: 1.2E-05oz; Package Quantity: 15000; Length: 0.024inch; Voltage Rating: 16V; Case Code (Imperial): 0201; Packaging: Tape and Reel; Thickness: 0.013inch; Width: 0.3mm
C23 = CMP-03422-000819-1: as C16 on sheet Power; Digikey Description: CAP CER 4.7UF 16V X5R 0402; Capacitance: 4.7 uF; Lead Free: Yes; Octopart: https://octopart.com/cc0402mrx5r7bb475-yageo-81932628; Device Class L3: Ceramic Capacitors; Ipc Land Pattern Name: CAPC10050X50; Package: CC0402; Temperature: -55°C to +125°C; Device Class L2: Capacitors; Value: 4.7 uF; Temperature Characteristic: X5R; ComponentLink2URL: http://www.yageo.com/documents/recent/UPY-GP_NP0_16V-to-50V_16.pdf; Temperature Range Low: -55°C; Automotive: No; ComponentLink2Description: Datasheet; Category: Cap; Mouser Description: Multilayer Ceramic Capacitors MLCC - SMD/SMT 4.7uF 16V 20% Ceramic Capacitor; Temperature Range High: +125°C; Voltage Rating: 16 V; Footprint Url: http://www.yageo.com/exep/pages/download/literatures/UPY-C_GEN_24.pdf; Height: 0.55mm; RoHS: TRUE; Device Class L1: Passive Components
R8 = CMP-2004-00209-1: as R1 on sheet MCU
U3 = CMP-2000-04924-1: Single-Chip USB to URAT Bridge, 3.3 V, -40 to 85 degC, 28-Pin QFN, RoHS, Tape and Reel; Manufacturer: Silicon Labs; Interface Circuit Standard 1: RS-232; Transmitter and Receiver FIFO Counter: No; Supply Current: 26mA; Operating Supply Voltage (Min): 3V; Operating Supply Voltage (Typ): 3.3V; Data Rate: 1000kbps; Operating Supply Voltage (Max): 3.6V; Number of Channels: 1; Package URL: http://www.silabs.com/Support%20Documents/TechnicalDocs/C8051T61x.pdf; Operating Temperature (Max): 85C; Datasheet URL: http://www.mouser.com/ds/2/368/CP2102-9-247052.pdf; Operating Temperature Classification: Industrial; Operating Temperature (Min): -40C; Package Description: 28-Pin Quad-Flat No-Leads Package, Body 5 x 5 mm, Pitch 0.5 mm; Manufacturer URL: http://www.silabs.com/; Rad Hardened: No; Package Reference: QFN-28; Pin Count: 28; Packaging: TapeandReel; Mounting: SurfaceMount; Package Type: QFNEP; Datasheet Version: Rev. 1.6, 12/2013

## Nets that join several sheets
3V3: MCU (12 pins), Connector (C20.1 P1.1 P3.1), IMU (C21.1 C22.1 U4.5 U4.8), Power (C17.1 L5.2 R12.1 U2.8), USB_UART_Bridge (7 pins)
GND: MCU (20 pins), Connector (16 pins), IMU (C21.2 C22.2 U4.6 U4.7), Power (6 pins), USB_UART_Bridge (6 pins)
V_USB: Connector (C14.1 FB2.2), Power (C16.1 R5.1 R6.1 U2.2), USB_UART_Bridge (U3.8)
CSB: MCU (U1.9), IMU (U4.12)
INT1: MCU (U1.5), IMU (U4.4)
INT2: MCU (U1.11), IMU (U4.9)
nRST: MCU (R1.1 SW1.B1 SW1.B2 U1.30), Connector (P1.10 P2.9)
P0.00: MCU (U1.23), Connector (P2.2)
P0.01: MCU (U1.24), Connector (P2.1)
P1.02: MCU (U1.3), Connector (P3.4)
P1.03: MCU (U1.4), Connector (P3.3)
P1.09: MCU (U1.37), Connector (P3.10)
P1.10: MCU (U1.38), Connector (P3.9)
P1.11: MCU (U1.39), Connector (P3.8)
P1.12: MCU (U1.40), Connector (P3.7)
P1.13: MCU (U1.41), Connector (P3.6)
P1.14: MCU (U1.42), Connector (P3.5)
P2.04: MCU (U1.15), Connector (P2.8), IMU (U4.1)
P2.05: MCU (U1.16), Connector (P2.7)
P2.06: MCU (U1.17), Connector (P2.6), IMU (U4.13)
P2.08: MCU (U1.19), Connector (P2.5), IMU (U4.14)
P2.09: MCU (U1.20), Connector (P2.4)
P2.10: MCU (U1.21), Connector (P2.3)
SWCLK: MCU (U1.26), Connector (P1.4)
SWDIO: MCU (U1.25), Connector (P1.2)
SWO: MCU (U1.18), Connector (P1.6)
UART_RX: MCU (U1.2), USB_UART_Bridge (U3.25)
UART_TX: MCU (U1.1), USB_UART_Bridge (U3.26)
USBD_N: Connector (FL1.6), USB_UART_Bridge (U3.5)
USBD_P: Connector (FL1.7), USB_UART_Bridge (U3.4)